# Altium project Projektna.PrjPcb
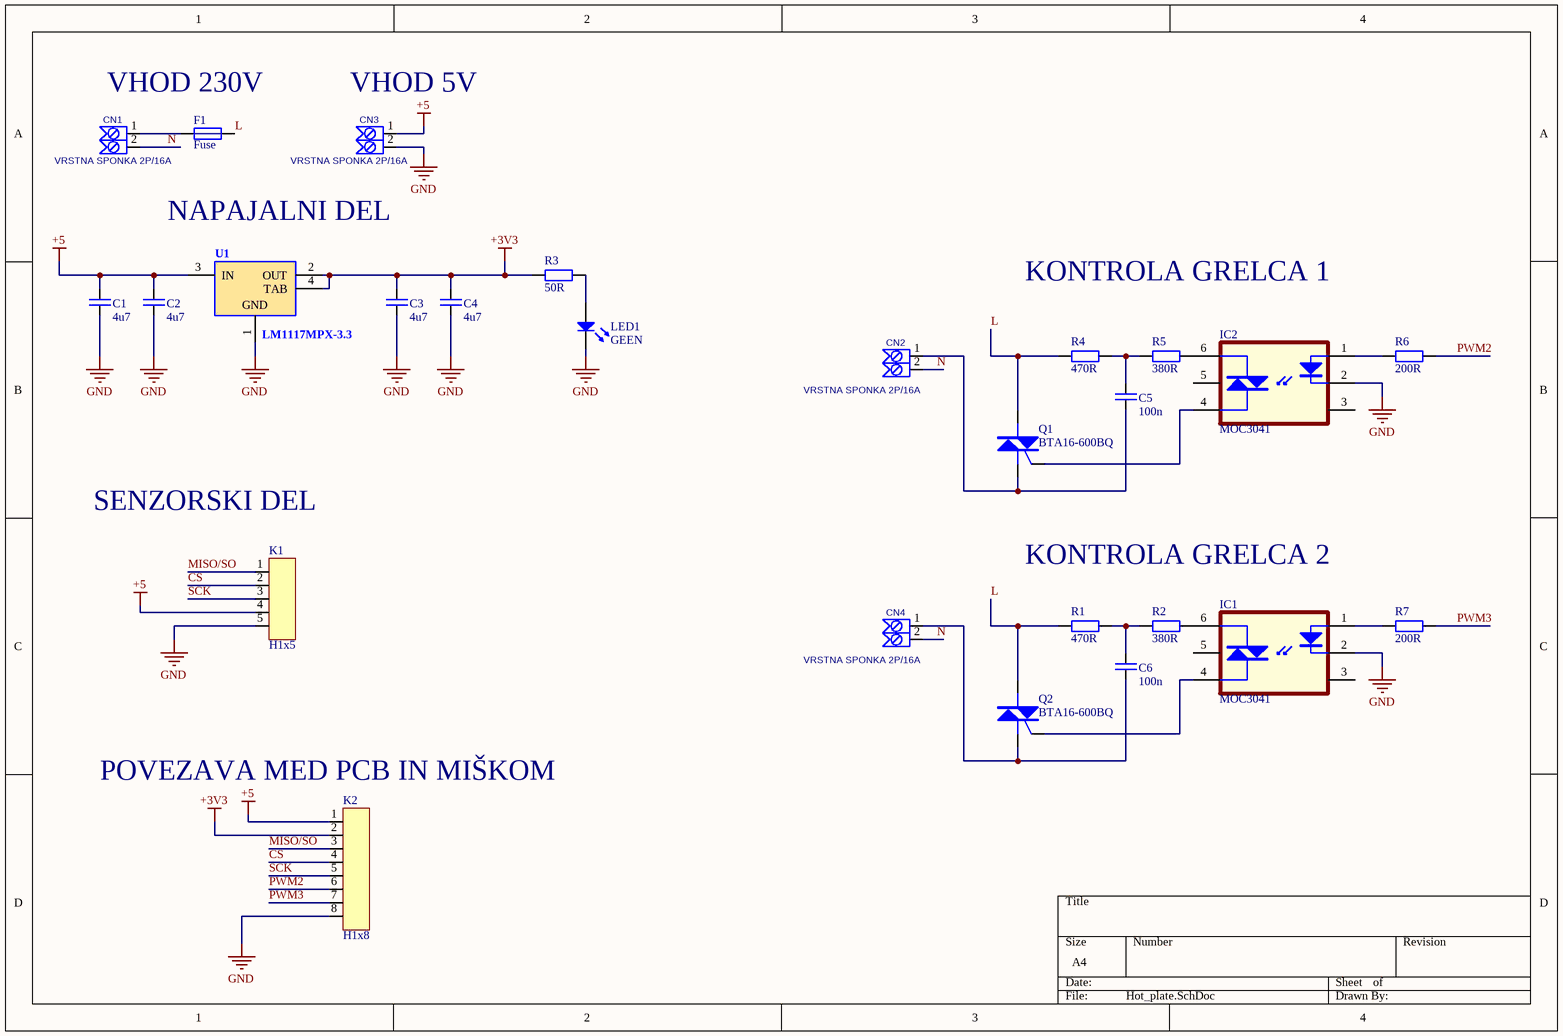
[diagram p0: Hot_plate.SchDoc]
1 sheet, 26 parts. Net scope: global (net labels, ports and power ports of the same name join across sheets).
Board file: Hot_plate.PcbDoc

## Sheet Hot_plate.SchDoc
size A4; SheetNumber: 1; SheetTotal: 1

### Parts
C1  4u7  [C2012_0805I_M]
C2  4u7  [C2012_0805I_M]
C3  4u7  [C2012_0805I_M]
C4  4u7  [C2012_0805I_M]
C5  100n  [C ceramic F5mm]
C6  100n  [C ceramic F5mm]
CN1  VRSTNA SPONKA 2P/16A  [VRSTNA SPONKA 2P/16A]
CN2  VRSTNA SPONKA 2P/16A  [VRSTNA SPONKA 2P/16A]
CN3  VRSTNA SPONKA 2P/16A  [VRSTNA SPONKA 2P/16A]
CN4  VRSTNA SPONKA 2P/16A  [VRSTNA SPONKA 2P/16A]
F1  Fuse  [FUSE-holder]
IC1  MOC3041  [DIP-6_L]
IC2  MOC3041  [DIP-6_L]
K1  H1x5  [H1x5]
K2  H1x8  [H1x8]
LED1  GEEN  [LED-THT_5]
Q1  BTA16-600BQ  [TO-220AB]
Q2  BTA16-600BQ  [TO-220AB]
R1  470R  [R400]
R2  380R  [R400]
R3  50R  [R2012_0805I_M]
R4  470R  [R400]
R5  380R  [R400]
R6  200R  [R2012_0805I_M]
R7  200R  [R2012_0805I_M]
U1  LM1117MPX-3.3  [DCY0004A_M]

### Nets
+3V3: C3.1 C4.1 K2.2 R3.1 U1.2(OUT) U1.4(TAB)
+5: C1.1 C2.1 CN3.1 K1.4 K2.1 U1.3(IN)
GND: C1.2 C2.2 C3.2 C4.2 CN3.2 IC1.2(Cathode) IC2.2(Cathode) K1.5 K2.8 LED1.2(K) U1.1(GND)
CS: K1.2 K2.4
L: F1.2 Q1.2(M2) Q2.2(M2) R1.1 R4.1
MISO/SO: K1.1 K2.3
N: CN1.2 CN2.2 CN4.2
PWM2: K2.6 R6.2
PWM3: K2.7 R7.2
SCK: K1.3 K2.5
NetC5_1: C5.1 R4.2 R5.1
NetC5_2: C5.2 CN2.1 Q1.1(M1)
NetC6_1: C6.1 R1.2 R2.1
NetC6_2: C6.2 CN4.1 Q2.1(M1)
NetCN1_1: CN1.1 F1.1
NetIC1_1: IC1.1(Anode) R7.1
NetIC1_4: IC1.4(Main_terminal) Q2.3(G)
NetIC1_6: IC1.6(Main_terminal) R2.2
NetIC2_1: IC2.1(Anode) R6.1
NetIC2_4: IC2.4(Main_terminal) Q1.3(G)
NetIC2_6: IC2.6(Main_terminal) R5.2
NetLED1_1: LED1.1(A) R3.2

Not connected (* = marked no-connect by the designer): IC1 3(NC) 5(Substrate); IC2 3(NC) 5(Substrate)

### Notes on the sheet
- VHOD 230V
- (near CN3) VHOD 5V
- NAPAJALNI DEL
- KONTROLA GRELCA 1
- SENZORSKI DEL
- KONTROLA GRELCA 2
- (near K2) POVEZAVA MED PCB IN MIŠKOM

### Library data of the parts
C1-C6 = C: Capacitor
IC1 IC2 = MOC3041M: Zero-Cross Oproisolator Triac Driver Output; Manufacturer: FAIRCHILD SEMICONDUCTOR; Case Style: DIP 6; AVK Code: 3064001000; Manufacturer Part Number: MOC3041M; RoHS: YES; Pricing: 1=1,31, 25=0,9, 100=0,72, 250=0,61, 500=0,35 (EUR); ComponentLink1URL: http://www.farnell.com/datasheets/1639837.pdf; ComponentLink1Description: Datasheet; ComponentLink2URL: http://www.farnell.com/datasheets/410597.pdf; ComponentLink2Description: Datasheet 2
K1 = H1x5: Header 1x5 (male)
K2 = H1x8: Header 1x8 (male)
LED1 = LED: L-7104ZGCK; AVK Code: 17002000201; Case Style: 0805 [2012 Metric]; Published: 8-Jun-2000; LatestRevisionDate: 08-Jul-2005; LatestRevisionNote: Mech Layer 1 removed.; PackageReference: LED-0; Publisher: Altium Limited; PackageDescription: LED; 2 Leads
Q1 Q2 = Triac: SENSITIVE GATE TRIAC
R1-R7 = R
U1 = LM1117MPX-3.3: 800mA Low-Dropout Linear Regulator, 4-pin SOT-223, Pb-Free / DataSheet: / https://www.ti.com/lit/ds/symlink/lm1117.pdf?ts=1629838143263&ref_url=https%253A%252F%252Fwww.google.com%252F; PartNumber: LM1117MPX-3.3/NOPB; Manufacturer: Texas Instruments; High-Reliability: Y; PowerWise: N; PackageTopMarking: XYTT*N05A; CompType: LDO IC; Code: FRL-33-LM1117; ComponentLink1URL: http://www.ti.com/general/docs/lit/getliterature.tsp?genericPartNumber=LM1117-N&fileType=pdf; ComponentLink1Description: Datasheet URL; PinCount: 4; Code_JEDEC: TO-261-AA; PackageDescription: Molded SOT-223, 6.50 x 3.56 x 1.6mm Body, 4 Lead, 2.3mm Pitch; PackageReference: DCY0004A; RoHS: Y; Code_IPC: SOT223-4
CN1-CN4 = VRSTNA SPONKA 2P/16A: Value: *
F1 = Fuse: ComponentLink1URL: http://www.littelfuse.com/data/en/Data_Sheets/646_648_640_LF_050901.pdf; ComponentLink1Description: http://www.littelfuse.com/data/en/Data_Sheets/646_648_640_LF_050901.pdf